# Altium schematic sheet AMU-S32-V00-TSALControlNEW.SchDoc
size A3; SheetNumber: 19; SheetTotal: 19
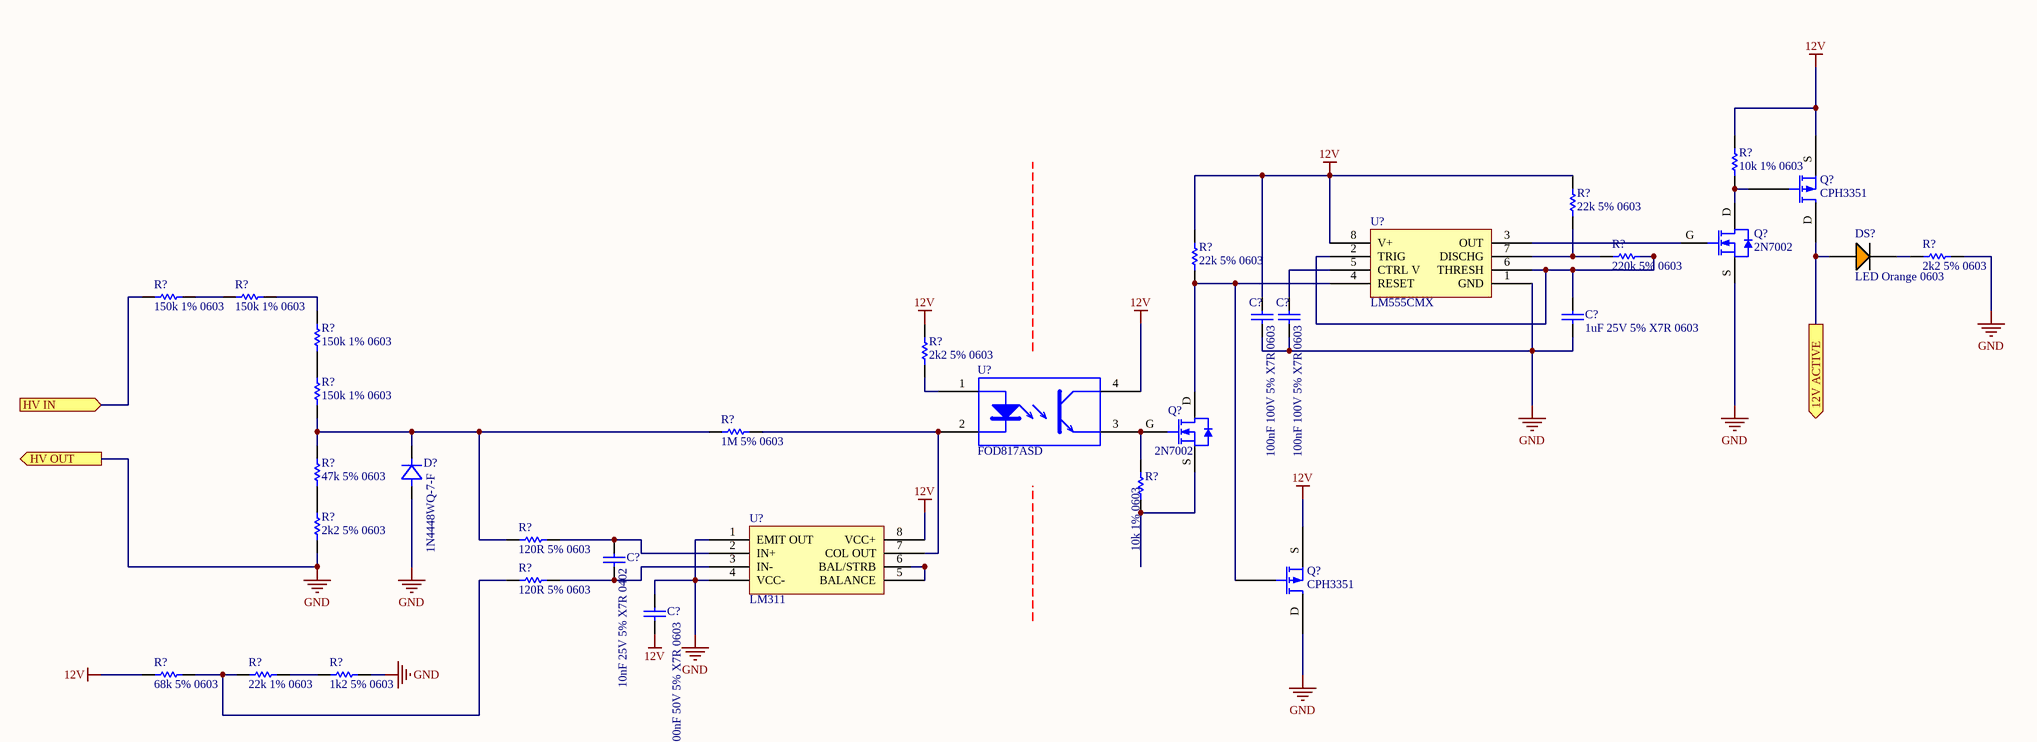
[diagram p0: AMU-S32-V00-TSALControlNEW.SchDoc]

## Parts
(Parts that share a designator on the sheet are numbered #1, #2 ... from top to bottom, then left to right.)
C?#1  100nF 100V 5% X7R 0603  [Cap_Ceramic_0603]
C?#2  100nF 100V 5% X7R 0603  [Cap_Ceramic_0603]
C?#3  1uF 25V 5% X7R 0603  [Cap_Ceramic_0603]
C?#4  10nF 25V 5% X7R 0402  [Cap_Ceramic_0603]
C?#5  100nF 50V 5% X7R 0603  [Cap_Ceramic_0603]
D?  1N4448WQ-7-F  [SMA]
DS?  LED Orange 0603  [LED ORANGE 0603]
Q?#1  CPH3351  [SOT-23-3]
Q?#2  2N7002  [SOT23-3]
Q?#3  2N7002  [SOT23-3]
Q?#4  CPH3351  [SOT-23-3]
R?#1  10k 1% 0603  [Res_ThinFilm_0603]
R?#2  22k 5% 0603  [Res_ThinFilm_0603]
R?#3  22k 5% 0603  [Res_ThinFilm_0603]
R?#4  220k 5% 0603  [Res_ThinFilm_0603]
R?#5  2k2 5% 0603  [Res_ThinFilm_0603]
R?#6  150k 1% 0603  [Res_ThinFilm_0603]
R?#7  150k 1% 0603  [Res_ThinFilm_0603]
R?#8  150k 1% 0603  [Res_ThinFilm_0603]
R?#9  2k2 5% 0603  [Res_ThinFilm_0603]
R?#10  150k 1% 0603  [Res_ThinFilm_0603]
R?#11  1M 5% 0603  [Res_ThinFilm_0603]
R?#12  47k 5% 0603  [Res_ThinFilm_0603]
R?#13  10k 1% 0603  [Res_ThinFilm_0603]
R?#14  2k2 5% 0603  [Res_ThinFilm_0603]
R?#15  120R 5% 0603  [Res_ThinFilm_0603]
R?#16  120R 5% 0603  [Res_ThinFilm_0603]
R?#17  68k 5% 0603  [Res_ThinFilm_0603]
R?#18  22k 1% 0603  [Res_ThinFilm_0603]
R?#19  1k2 5% 0603  [Res_ThinFilm_0603]
U?#1  FOD817ASD
U?#2  LM555CMX  [8-SOIC]
U?#3  LM311

## Ports
12V ACTIVE (out), HV IN (in), HV OUT (out)

## Nets
12V: C?#1.2 C?#5.1 Q?#1.S Q?#4.S R?#1.2 R?#2.2 R?#3.2 R?#9.2 R?#17.1 U?#1.4 U?#2.8(V+) U?#3.8(VCC+)
GND: C?#1.1 C?#2.1 C?#3.1 C?#5.2 D?.A(Anode) Q?#2.S Q?#4.D R?#5.1 R?#14.1 R?#19.2 U?#2.1(GND) U?#3.1(EMIT_OUT) U?#3.4(VCC-) ; port HV OUT
12V ACTIVE: DS?.1(A) Q?#1.D ; port 12V ACTIVE
HV IN: R?#6.1 ; port HV IN
NetC?#2_2: C?#2.2 U?#2.5(CTRL_V)
NetC?#3_2: C?#3.2 R?#4.2 U?#2.2(TRIG) U?#2.6(THRESH)
NetC?#4_1: C?#4.1 R?#16.2 U?#3.3(IN-)
NetC?#4_2: C?#4.2 R?#15.2 U?#3.2(IN+)
NetD?_K: D?.K(Cathode) R?#10.1 R?#11.1 R?#12.2 R?#15.1
NetDS?_2: DS?.2(C) R?#5.2
NetQ?#1_G: Q?#1.G Q?#2.D R?#1.1
NetQ?#2_G: Q?#2.G U?#2.3(OUT)
NetQ?#3_D: Q?#3.D Q?#4.G R?#3.1 U?#2.4(RESET)
NetQ?#3_G: Q?#3.G R?#13.2 U?#1.3
NetQ?#3_S: Q?#3.S R?#13.1
NetR?#2_1: R?#2.1 R?#4.1 U?#2.7(DISCHG)
NetR?#6_2: R?#6.2 R?#7.1
NetR?#7_2: R?#7.2 R?#8.2
NetR?#8_1: R?#8.1 R?#10.2
NetR?#9_1: R?#9.1 U?#1.1
NetR?#11_2: R?#11.2 U?#1.2 U?#3.7(COL_OUT)
NetR?#12_1: R?#12.1 R?#14.2
NetR?#16_1: R?#16.1 R?#17.2 R?#18.1
NetR?#18_2: R?#18.2 R?#19.1
NetU?#3_5: U?#3.5(BALANCE) U?#3.6(BAL/STRB)

## Library data of the parts
C?#1 C?#2 = 100nF 100V 5% X7R 0603: Capacitor, Ceramic, SMD, 100nF, 100V, 5%, X7R, 0603
C?#3 = 1uF 25V 5% X7R 0603: Capacitor, Ceramic, SMD, 1uF, 25V, 5%, X7R, 0603
C?#4 = 10nF 25V 5% X7R 0402: 10000pF ±5% 25V Ceramic Capacitor X7R 0402 (1005 Metric) /; ComponentLink1Description: Digikey; ComponentLink1URL: https://www.digikey.com/product-detail/en/murata-electronics/GRM155R71E103JA01J/490-6340-1-ND/3845537; ComponentLink2Description: Datasheet; ComponentLink2URL: https://search.murata.co.jp/Ceramy/image/img/A01X/G101/ENG/GRM155R71E103JA01-01.pdf
C?#5 = 100nF 50V 5% X7R 0603: Capacitor, Ceramic, SMD, 100nF, 50V, 5%, X7R, 0603
D? = 1N4448WQ-7-F_1: Diode, SMD, 75V, 5%, 250mA, SOD123; Manufacturer: ON Semiconductor / Fairchild; Manufacturer Part Number: 1N914BWS; Average Rectified Current: 150mA; Element Configuration: Single; Forward Voltage: 1V; Max Reverse Leakage Current: 5uA; Power Dissipation: 200mW; Recovery Time: 4ns; Max Forward Surge Current (Ifsm): 4A; Parameter 1: *; Weight: 0.0276g; Category: Rectifier Diodes; Contact Plating: Tin,Matte; Forward Current: 150mA; Lead Free: Lead Free; Max Operating Temperature: 150°C; Max Repetitive Reverse Voltage (Vrrm): 75V; Max Reverse Voltage (DC): 75V; Min Operating Temperature: -55°C; Mount: Surface Mount; Number of Pins: 2; Package Quantity: 1; Packaging: Tape and Reel; Peak Reverse Current: 5uA; Radiation Hardening: No; REACH SVHC: No SVHC; Reverse Recovery Time: 4ns; Height: 1mm; Length: 1.8mm; Reverse Voltage: 75V; Width: 1.35mm
Q?#1 Q?#4 = CPH3351: P-Channel 60V 1.8A (Ta) 1W (Ta) Surface Mount 3-CPH; ComponentLink1Description: Datasheet; ComponentLink1URL: https://www.onsemi.com/pub/Collateral/CPH3351-D.PDF; ComponentLink2Description: Digikey; ComponentLink2URL: https://www.digikey.com/products/en/discrete-semiconductor-products/transistors-fets-mosfets-single/278?k=&pkeyword=&sv=0&pv7=2&sf=0&FV=-1%7C488%2C-8%7C278&mpart=CPH3351-TL-W&quantity=&ColumnSort=0&page=1&stock=1&nstock=1&datasheet=1&photo=1&pageSize=25
R?#1 R?#13 = 10k 1% 0603: Resistor, SMD, 10k, 0.1W, 1%, 0603
R?#2 R?#3 = 22k 5% 0603: Resistor, SMD, 22k, 0.1W, 5%, 0603
R?#4 = 220k 5% 0603: Resistor, SMD, 220k, 0.1W, 5%, 0603
R?#5 R?#9 R?#14 = 2k2 5% 0603: Resistor, SMD, 2k2, 0.1W, 5%, 0603
R?#6-R?#8 R?#10 = 150k 1% 0603: Resistor, SMD, 150k, 0.1W, 1%, 0603
R?#11 = 1M 5% 0603: Resistor, SMD, 1M, 0.1W, 5%, 0603
R?#12 = 47k 5% 0603: Resistor, SMD, 47k, 0.1W, 5%, 0603
R?#15 R?#16 = 120R 5% 0603: Resistor, SMD, 120R, 0.1W, 5%, 0603
R?#17 = 68k 5% 0603: Resistor, SMD, 68k, 0.1W, 5%, 0603
R?#18 = 22k 1% 0603: Resistor, SMD, 22k, 0.1W, 1%, 0603
R?#19 = 1k2 5% 0603: Resistor, SMD, 1k2, 0.1W, 5%, 0603
U?#2 = LM555CMX: 555 Type, Timer/Oscillator (Single) IC 100kHz 8-SOIC; ComponentLink1Description: Digikey; ComponentLink1URL: https://www.digikey.com.au/product-detail/en/texas-instruments/LM555CMX%2FNOPB/LM555CMX%2FNOPBCT-ND/1010545?utm_adgroup=Integrated%20Circuits&utm_source=google&utm_medium=cpc&utm_campaign=Dynamic%20Search_EN_Product&utm_term=&productid=&gclid=CjwKCAjwr7X4BRA4EiwAUXjbt-N3vibcCncJp7dB6lpBrLRT-QxYTJoHZmGPqFSswFIeP9Lhu7cYVBoCjmMQAvD_BwE; ComponentLink2Description: Datasheet; ComponentLink2URL: https://www.ti.com/general/docs/suppproductinfo.tsp?distId=10&gotoUrl=http%3A%2F%2Fwww.ti.com%2Flit%2Fgpn%2Flm555
U?#3 = LM311: Differential Comparator